# EAGLE design Modular-LED-Lamp_driver_integrated (EAGLE 8.2.0)
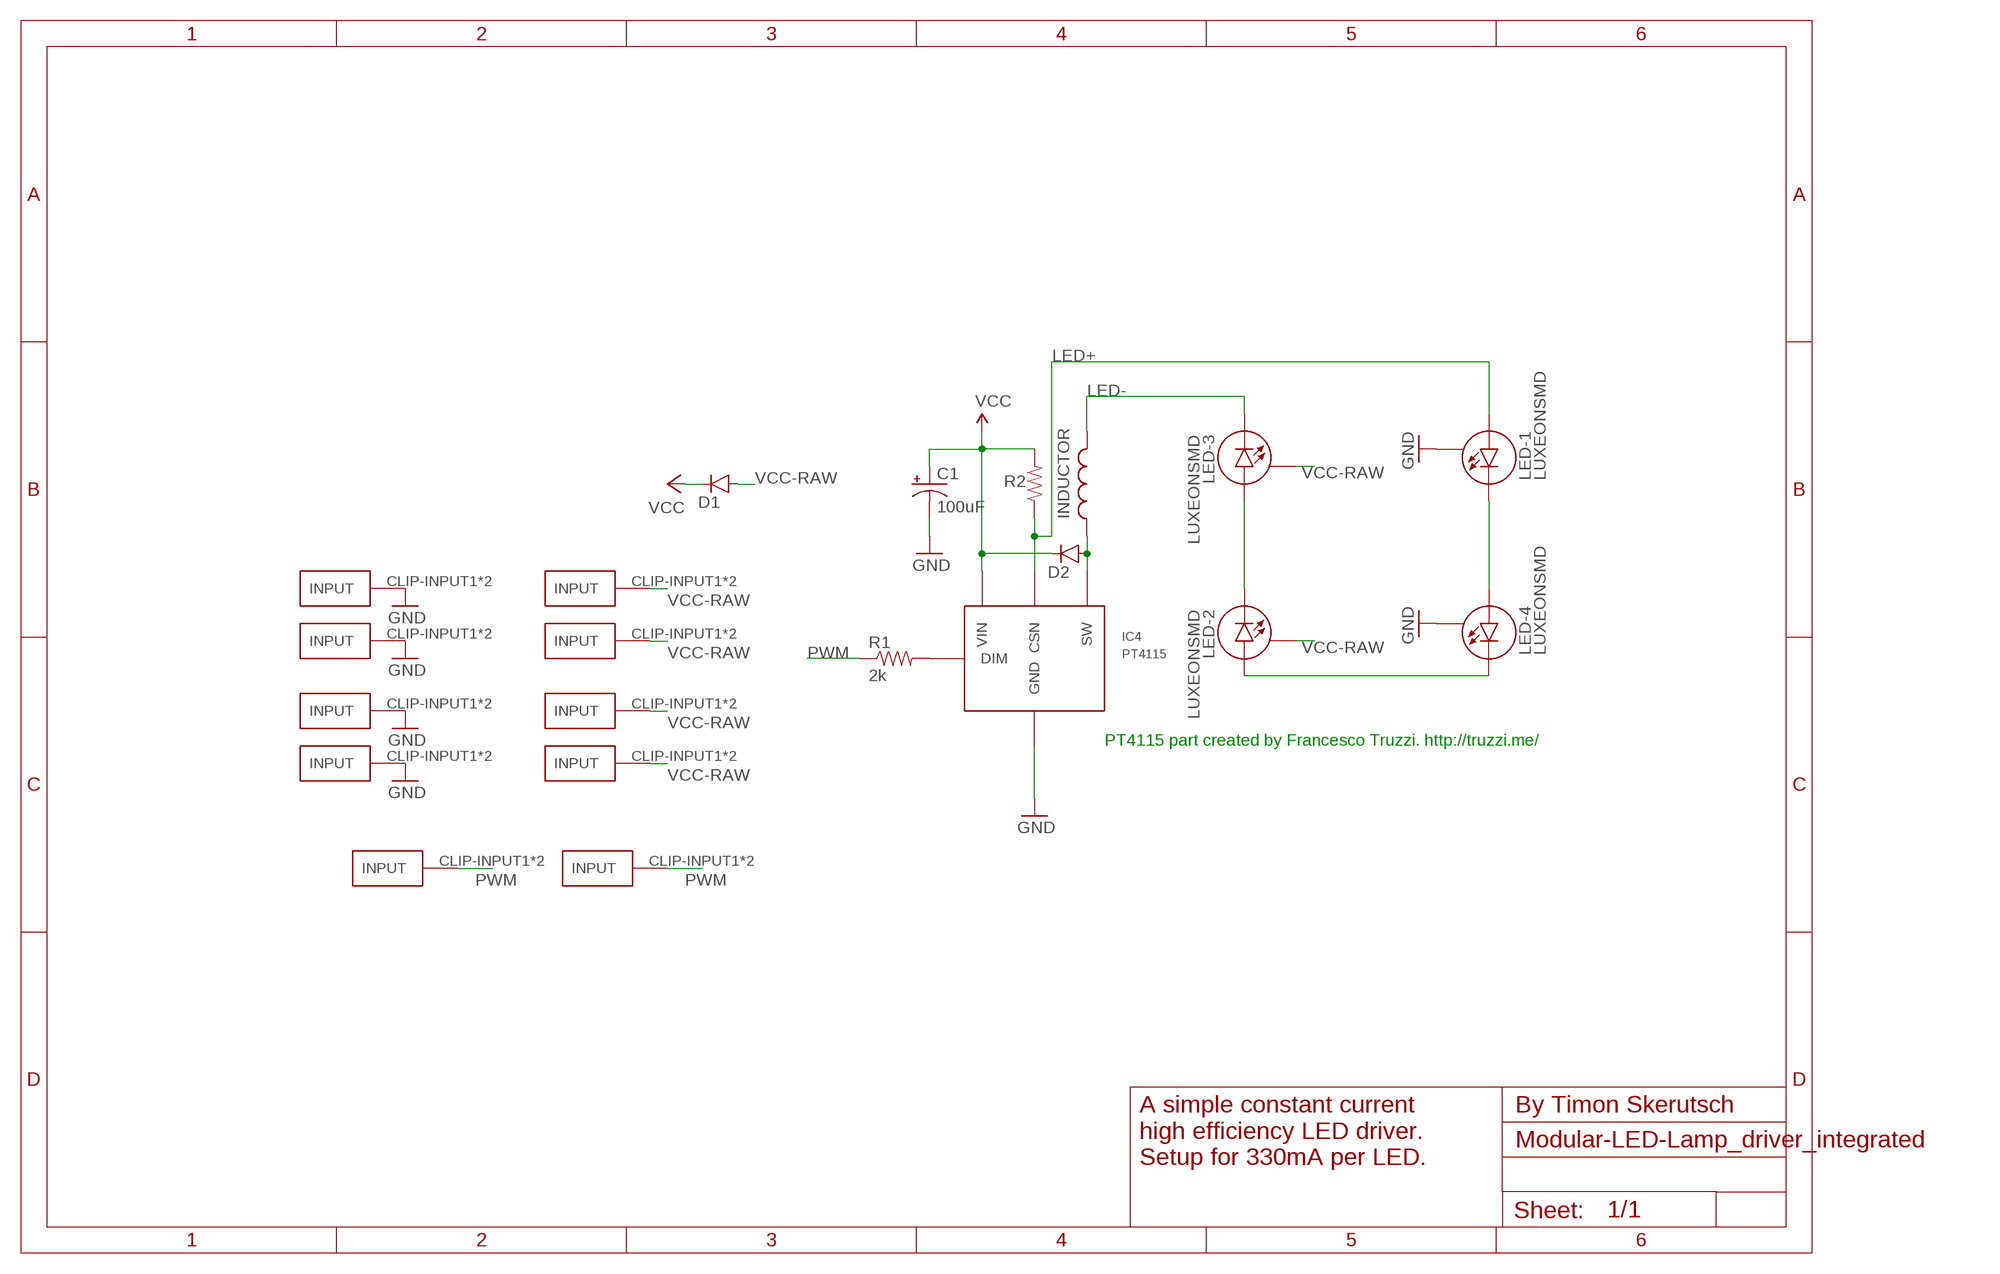
[diagram p0: schematic, sheet 1]

## Parts
C1  100uF  CAP_POLE  [PANASONIC_E]
D1  DIODESMA-KIT  [SMA-DIODE-KIT]
D2  DIODESMA-KIT  [SMA-DIODE-KIT]
GND-CLIP  FUSE-HOLDER-5X20MM  [FUSE-HOLDER-5X20MM]
GND-CLIP1  FUSE-HOLDER-5X20MM  [FUSE-HOLDER-5X20MM]
GND-CLIP2  FUSE-HOLDER-5X20MM  [FUSE-HOLDER-5X20MM]
GND-CLIP3  FUSE-HOLDER-5X20MM  [FUSE-HOLDER-5X20MM]
IC4  PT4115  [PT4115]
INDUCTOR  MSS1260  [MSS1260]
LED-1  LUXEONSMD  [LUXEON]
LED-2  LUXEONSMD  [LUXEON]
LED-3  LUXEONSMD  [LUXEON]
LED-4  LUXEONSMD  [LUXEON]
PWM-CLIP  FUSE-HOLDER-5X20MM  [FUSE-HOLDER-5X20MM]
PWM-CLIP1  FUSE-HOLDER-5X20MM  [FUSE-HOLDER-5X20MM]
R1  2k  RESISTOR1206  [1206]
R2  0.3  RESISTOR1206  [1206]
VCC-CLIP  FUSE-HOLDER-5X20MM  [FUSE-HOLDER-5X20MM]
VCC-CLIP1  FUSE-HOLDER-5X20MM  [FUSE-HOLDER-5X20MM]
VCC-CLIP2  FUSE-HOLDER-5X20MM  [FUSE-HOLDER-5X20MM]
VCC-CLIP3  FUSE-HOLDER-5X20MM  [FUSE-HOLDER-5X20MM]

## Nets
GND: C1.- GND-CLIP1.CLIP-INPUT1(INPUT) GND-CLIP1.CLIP-INPUT2(INPUT) GND-CLIP2.CLIP-INPUT1(INPUT) GND-CLIP2.CLIP-INPUT2(INPUT) GND-CLIP3.CLIP-INPUT1(INPUT) GND-CLIP3.CLIP-INPUT2(INPUT) GND-CLIP.CLIP-INPUT1(INPUT) GND-CLIP.CLIP-INPUT2(INPUT) IC4.2(GND) IC4.2A(GND) LED-1.S LED-4.S
LED+: IC4.4(CSN) LED-1.A R2.1
LED-: INDUCTOR.P$1 LED-3.C
N$1: D2.A IC4.1(SW) INDUCTOR.P$2
N$2: LED-2.A LED-4.C
N$3: LED-2.C LED-3.A
N$4: LED-1.C LED-4.A
N$5: IC4.3(DIM) R1.2
PWM: PWM-CLIP1.CLIP-INPUT1(INPUT) PWM-CLIP1.CLIP-INPUT2(INPUT) PWM-CLIP.CLIP-INPUT1(INPUT) PWM-CLIP.CLIP-INPUT2(INPUT) R1.1
VCC [VCC]: C1.+ D1.C D2.C IC4.5(VIN) R2.2
VCC-RAW [VCC]: D1.A LED-2.S LED-3.S VCC-CLIP1.CLIP-INPUT1(INPUT) VCC-CLIP1.CLIP-INPUT2(INPUT) VCC-CLIP2.CLIP-INPUT1(INPUT) VCC-CLIP2.CLIP-INPUT2(INPUT) VCC-CLIP3.CLIP-INPUT1(INPUT) VCC-CLIP3.CLIP-INPUT2(INPUT) VCC-CLIP.CLIP-INPUT1(INPUT) VCC-CLIP.CLIP-INPUT2(INPUT)

## Notes on the sheet
- PT4115 part created by Francesco Truzzi. http://truzzi.me/
- By Timon Skerutsch
- A simple constant current
  high efficiency LED driver.
  Setup for 330mA per LED.

## Library data of the parts
C1 = SparkFun-Capacitors:CAP_POL: Capacitor Polarized These are standard SMD and PTH capacitors. Normally 10uF, 47uF, and 100uF in electrolytic and tantalum varieties. Always verify the external diameter of the through hole cap, it varies with capacity, voltage, and manufacturer. The EIA devices should be standard.
D1 D2 = SparkFun-DiscreteSemi:DIODE: Diode These are standard reverse protection diodes and small signal diodes. SMA package can handle up to about 1A. SOD-323 can handle about 200mA. What the SOD-323 package when ordering, there are some mfgs out there that are 5-pin packages.
GND-CLIP GND-CLIP1-GND-CLIP3 PWM-CLIP PWM-CLIP1 VCC-CLIP VCC-CLIP1-VCC-CLIP3 = timon-diverses:FUSE-HOLDER-5X20MM
IC4 = PT4115:PT4115: 30V, 1.2A Step-down High Brightness LED Driver with 5000:1 Dimming PDF: http://www.google.pl/url?sa=t&rct=j&q=PT4115&source=web&cd=1&ved=0CC4QFjAA&url=http%3A%2F%2Fwww.micro-bridge.com%2Fdata%2FCRpowtech%2FPT4115E.pdf&ei=9NbxUKXPJNSzhAem2oGoAQ&usg=AFQjCNEsPWIIWjIVjxpF5YN6SPR3coTTpw&bvm=bv.1357700187,d.d2k
INDUCTOR = inductor-coilcraft:MSS1260: SMT Power Inductor
LED-1-LED-4 = SparkFun-LED:LUXEON: Luxeon LED This footprint works with the current 1 Watt, 3 Watt, and 5 Watt LEDs. These blindingly bright LEDs generate a lot of heat so the footprint has a large pad under the LED for thermal transfer. Schematic and footprint are proven. Spark Fun Electronics SKU : COM-00603
R1 R2 = SparkFun-Resistors:RESISTOR: Resistor Basic schematic elements and footprints for 0603, 1206, and PTH resistors.

## Net classes
1 VCC: clearance 0.508 mm

## Board
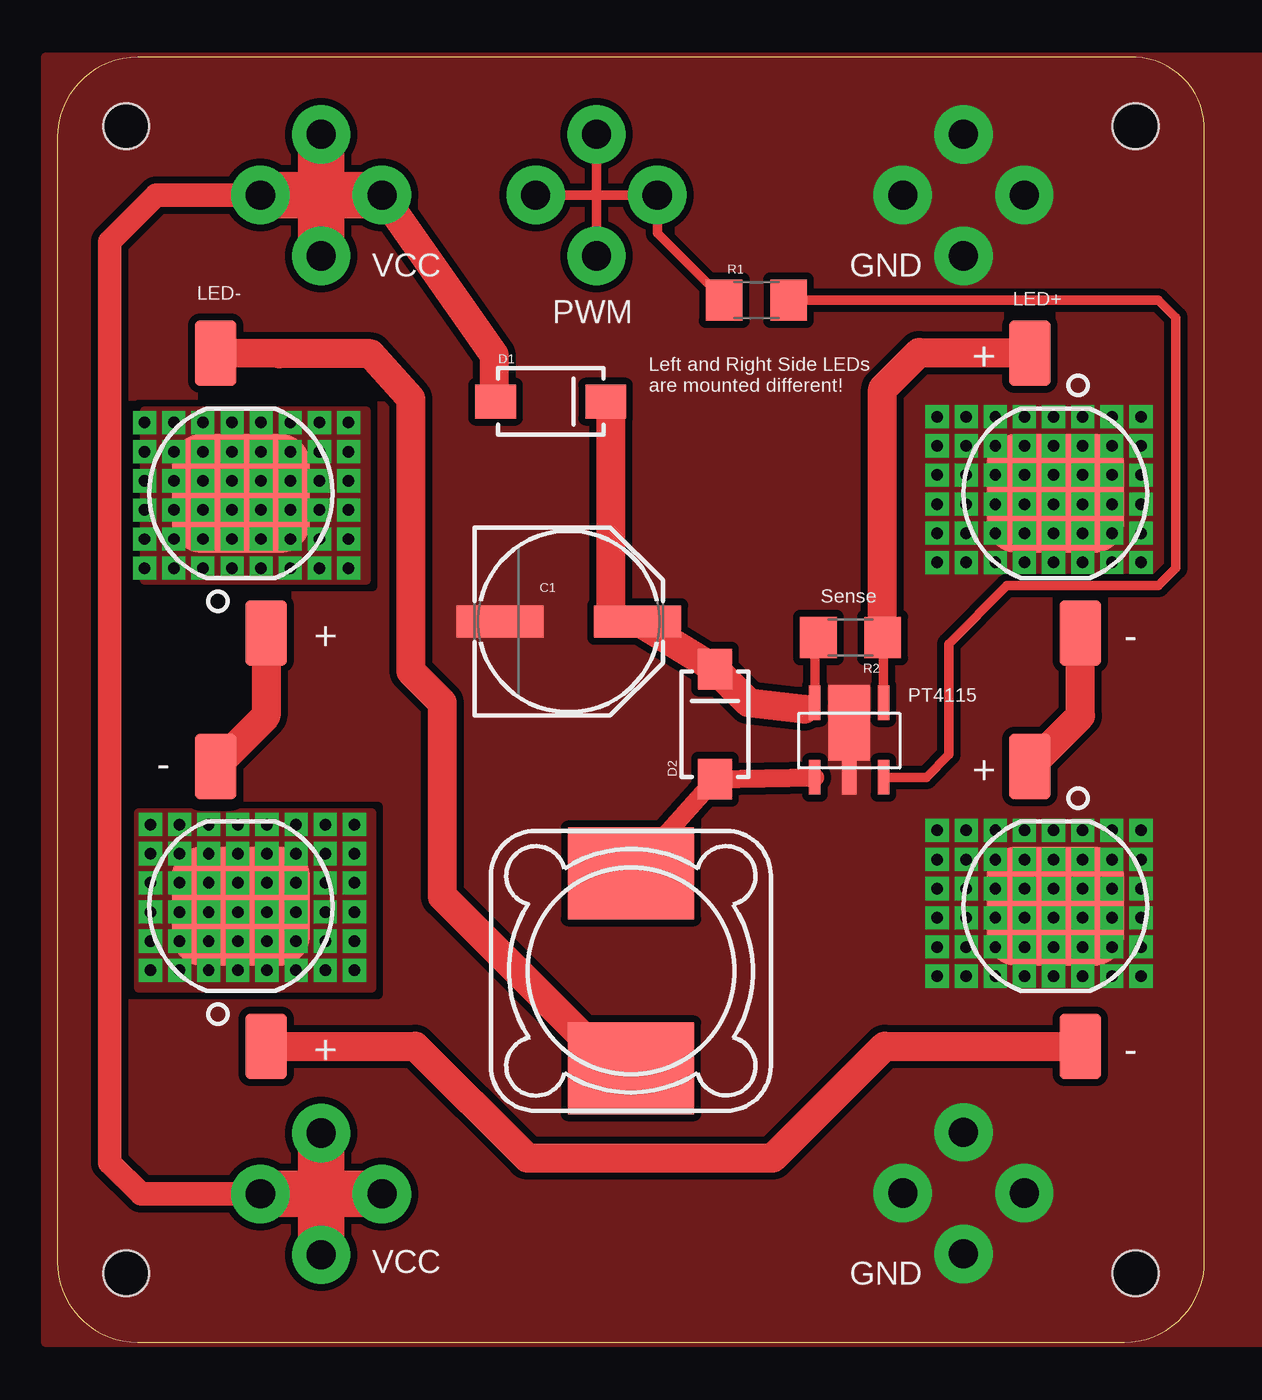
[diagram p1: board, top side]
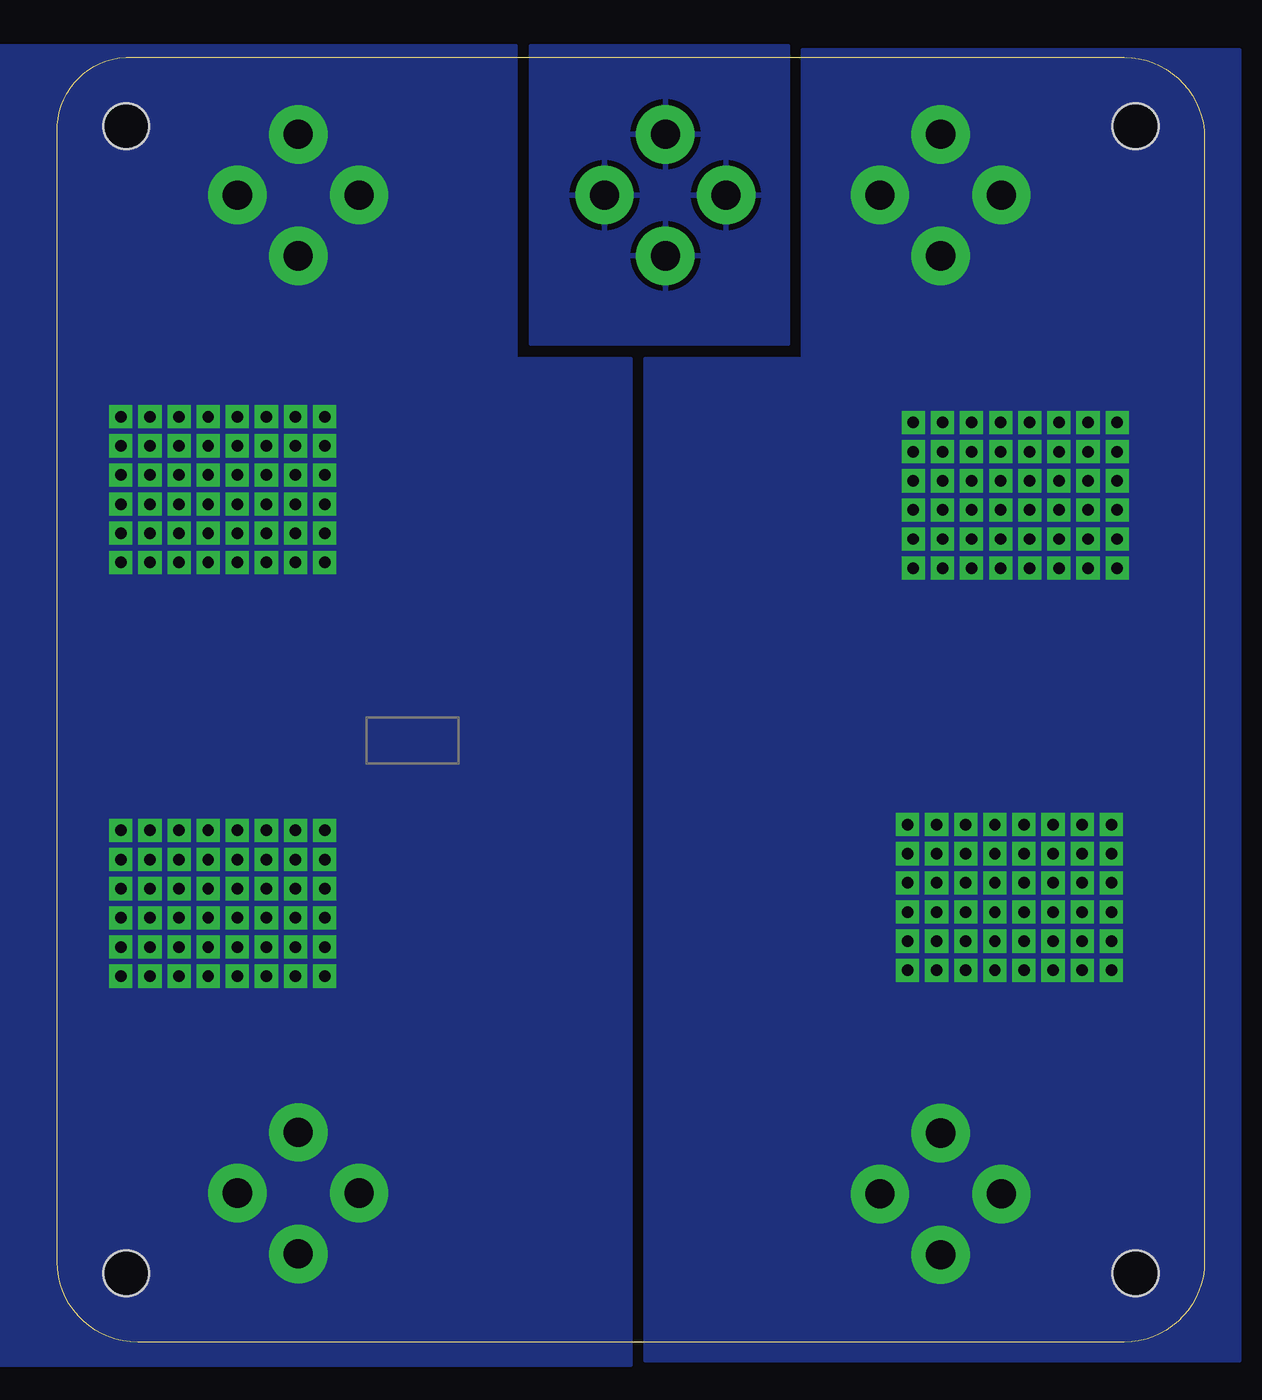
[diagram p2: board, bottom side, seen from below]

Size 50 x 56 mm. Coordinates in mm from the lower left corner, seen from the top.
Outline: 46.5,0 arc90 50,3.5 50,52.75 arc90 47.01,56 3.5,56 arc90 0,52.5 0,3.5 arc90 3.5,0 46.5,0
Copper layers (1*16): Top 0.035mm / dielectric 1.5mm / Bottom 0.035mm
Design rules "led_module": minimum track width 8mil, minimum drill 0.8mm, track to track 12mil, track to pad 12mil, pad to pad 12mil, via to via 12mil, smd to smd 0mil, copper to edge 0mil, drill to drill 1mil, minimum pad ring 10mil, minimum via ring 10mil, stop-mask expansion 1mil, vias tented up to drill 30mil, thermal gap 10mil
Holes 2 mm at 3,53 47,53 3,3 47,3

### Footprints (pad centres in the part's own frame; a part is rotated, then mirrored left to right if it is on the bottom)
PANASONIC_E = smd 3.8 x 1.4: + 3,0; - -3,0
SMA-DIODE-KIT = smd 1.77 x 1.47: A -2.4,0; C 2.4,0
FUSE-HOLDER-5X20MM = drill 1.27 pad 2.54: CLIP-INPUT1 -2.65,0; CLIP-INPUT2 2.65,0
PT4115 = smd 0.5 x 1.5: 1 0,0; 3 3,0; 4 3,3.25; 5 0,3.25 | smd 0.65 x 1.5: 2 1.5,0 | smd 1.8 x 3.3: 2A 1.5,2.375
MSS1260 = smd 5.5 x 4: P$1 0,4.25; P$2 0,-4.25
LUXEON = smd 2.85 x 1.8: A -6.1,-1.1; C 6.1,1.1 | smd 5.2 x 6: S 0,0
1206 = smd 1.6 x 1.8: 1 -1.4,0; 2 1.4,0

### Placement (x,y rotation side)
C1  22.29,31.41 0 top
D1  21.5,41 0 top
D2  28.66,26.94 90 top
GND-CLIP  39.5,50 0 top
GND-CLIP1  39.5,6.5 90 top
GND-CLIP2  39.5,6.5 0 top
GND-CLIP3  39.5,50 90 top
IC4  33.02,24.62 0 top
INDUCTOR  25,16.18 180 top
LED-1  43.5,37 270 top
LED-2  8,19 90 top
LED-3  8,37 90 top
LED-4  43.5,19 270 top
PWM-CLIP  23.5,50 0 top
PWM-CLIP1  23.5,50 90 top
R1  30.47,45.42 0 top
R2  34.57,30.71 180 top
VCC-CLIP  11.5,50 0 top
VCC-CLIP1  11.5,6.46 90 top
VCC-CLIP2  11.5,6.46 0 top
VCC-CLIP3  11.5,49.99 270 bottom

### Tracks (layer width: path | path; a pad name or v marks a point on that pad's centre or on a via)
GND  (via drill 0.5)
  other vias: 45.97,17.22 44.7,17.22 43.43,17.22 42.16,17.22 40.89,17.22 40.89,18.49 42.16,18.49 43.43,18.49 44.7,18.49 45.97,18.49 45.97,19.76 44.7,19.76 43.43,19.76 42.16,19.76 40.89,19.76 40.89,21.03 42.16,21.03 43.43,21.03 44.7,21.03 45.97,21.03 45.97,22.3 44.7,22.3 40.89,22.3 42.16,22.3 43.43,22.3 45.97,33.99 44.7,33.99 43.43,33.99 42.16,33.99 40.89,33.99 40.89,35.26 42.16,35.26 43.43,35.26 44.7,35.26 45.97,35.26 40.89,36.53 42.16,36.53 43.43,36.53 44.7,36.53 45.97,36.53 47.24,35.26 47.24,36.53 47.24,37.8 47.24,39.07 45.97,37.8 44.7,37.8 43.43,37.8 42.16,37.8 40.89,37.8 39.62,36.53 39.62,37.8 39.62,35.26 40.89,39.07 42.16,39.07 43.43,39.07 44.7,39.07 45.97,39.07 45.97,40.34 44.7,40.34 43.43,40.34 42.16,40.34 47.24,18.49 47.24,19.76 47.24,21.03 39.62,21.03 39.62,19.76 39.62,18.49 39.62,22.3 39.62,17.22 47.24,17.22 47.24,22.3 40.89,40.34 39.62,40.34 39.62,39.07 39.62,33.99 47.24,40.34 47.24,33.99 38.35,40.34 38.35,39.07 38.35,37.8 38.35,36.53 38.35,35.26 38.35,33.99 44.7,15.95 45.97,15.95 47.24,15.95 38.35,17.22 38.35,18.49 38.35,19.76 38.35,21.03 38.35,22.3 43.43,15.95 42.16,15.95 40.89,15.95 39.62,15.95 38.35,15.95
  pour Top (rank 2, no thermals): -0.5,56 52.5,56 52.5,0 -0.5,0
  pour Bottom (rank 2, no thermals): 25,42.87 30,42.87 30,56.5 53.5,56.5 53.5,-1 25,-1
LED+
  Top 0.406: IC4.4 36.02,30.2
  Top 0.559: 36.02,30.2 R2.1
  Top 1.27: R2.1 35.97,41.54 37.56,43.13 42.37,43.13 LED-1.A
LED-
  Top 1.27: INDUCTOR.P$1 24.27,11.93 16.78,19.43 16.78,27.86 15.41,29.23 15.41,41.12 13.66,43.08 9.68,43.08 LED-3.C
N$1
  Top 0.813: IC4.1 D2.A INDUCTOR.P$2
N$2
  Top 1.27: LED-2.A 15.61,12.9 20.49,8.02 31.18,8.02 36.06,12.9 LED-4.C
N$3
  Top 1.27: LED-3.A 9.1,27.3 LED-2.C
N$4
  Top 1.27: LED-4.A 44.6,27.3 LED-1.C
N$5
  Top 0.406: IC4.3 37.87,24.62 38.85,25.61 38.85,30.43 41.39,32.97 48,32.97 48.76,33.73 48.76,44.66 48,45.42 R1.2
PWM
  Top 0.406: PWM-CLIP.CLIP-INPUT1 23.36,50 | 23.36,50 23.61,50 | 23.61,50 PWM-CLIP.CLIP-INPUT2 26.15,48.34 R1.1 | PWM-CLIP1.CLIP-INPUT1 23.5,49.88 23.61,50 | PWM-CLIP1.CLIP-INPUT2 23.5,50.14 23.36,50
  pour Bottom (rank 3): 18.13,56.5 18.13,43.5 29.37,43.5 29.37,56.5
VCC
  Top 0.406: IC4.5 33.02,30.2
  Top 0.508: 32.55,27.59 IC4.5
  Top 0.559: 33.02,30.2 R2.2
  Top 1.27: 32.55,27.59 30.13,27.87 D2.C C1.+ 25.29,31.45 24.12,31.45 24.12,41 D1.C
VCC-RAW  (via drill 0.5)
  Top 1.016: VCC-CLIP2.CLIP-INPUT1 3.64,6.46 2.28,7.83 2.28,47.96 4.31,49.99 VCC-CLIP.CLIP-INPUT1
  Top 1.27: VCC-CLIP.CLIP-INPUT2 19.05,43 19.05,41 D1.A
  Top 2.032: VCC-CLIP.CLIP-INPUT1 11.5,50 | 11.5,50 VCC-CLIP.CLIP-INPUT2 | VCC-CLIP2.CLIP-INPUT2 11.42,6.46 | 11.42,6.46 VCC-CLIP2.CLIP-INPUT1 | VCC-CLIP1.CLIP-INPUT1 VCC-CLIP1.CLIP-INPUT2 11.5,6.54 11.42,6.46 | VCC-CLIP3.CLIP-INPUT2 11.5,50 | VCC-CLIP3.CLIP-INPUT1 11.5,50
  other vias: 11.42,40.08 12.69,40.08 12.69,38.81 12.69,37.54 12.69,36.27 12.69,35 11.42,35 10.15,33.73 11.42,33.73 12.69,33.73 11.42,38.81 11.42,37.54 11.42,36.27 10.15,35 10.15,36.27 10.15,37.54 10.15,38.81 10.15,40.08 8.88,40.08 8.88,38.81 8.88,37.54 8.88,36.27 8.88,35 8.88,33.73 7.61,33.73 7.61,35 7.61,36.27 7.61,37.54 7.61,38.81 7.61,40.08 6.34,40.08 6.34,38.81 6.34,37.54 6.34,36.27 6.34,35 6.34,33.73 5.07,33.73 5.07,35 5.07,36.27 5.07,37.54 5.07,38.81 5.07,40.08 3.8,40.08 3.8,38.81 3.8,37.54 3.8,36.27 3.8,35 3.8,33.73 4.06,22.56 4.06,21.29 4.06,20.02 4.06,18.75 4.06,17.48 4.06,16.21 5.33,16.21 6.6,16.21 7.87,16.21 9.14,16.21 10.41,16.21 11.68,16.21 12.95,16.21 12.95,17.48 12.95,18.75 12.95,20.02 12.95,21.29 12.95,22.56 11.68,22.56 10.41,22.56 9.14,22.56 7.87,22.56 6.6,22.56 5.33,22.56 5.33,21.29 6.6,21.29 7.87,21.29 9.14,21.29 10.41,21.29 11.68,21.29 11.68,20.02 10.41,20.02 9.14,20.02 7.87,20.02 6.6,20.02 5.33,20.02 5.33,18.75 6.6,18.75 7.87,18.75 9.14,18.75 10.41,18.75 11.68,18.75 11.68,17.48 10.41,17.48 9.14,17.48 7.87,17.48 6.6,17.48 5.33,17.48
  pour Bottom (no thermals): -1.53,56.34 -1.53,-0.81 24.38,-0.81 24.38,42.88 17.52,42.88 17.52,56.34
  pour Top (no thermals): 3.8,40.59 13.45,40.59 13.45,33.23 3.8,33.23
  pour Top (no thermals): 13.71,23.07 3.55,23.07 3.55,15.45 13.71,15.45

### Text on the board
tPlace: + | Left and Right Side LEDs / are mounted different! | Sense | + | - | - | + | + | -
tNames: VCC | GND | LED- | LED+ | PWM | PT4115 | VCC | GND